# EAGLE design Herfstkamp v1 (EAGLE 7.1.0)
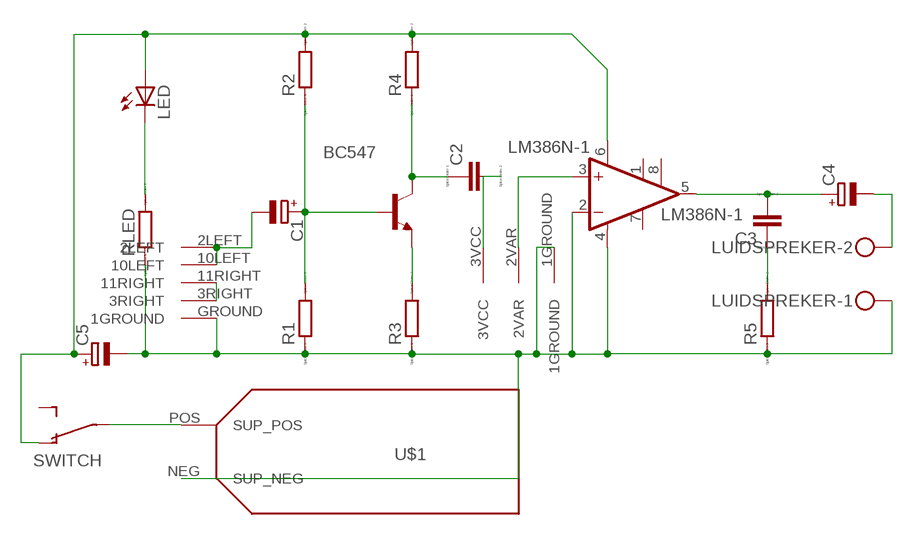
[diagram p0: schematic, sheet 1]

## Parts
BC547  -NPN-TO92-CBE  [TO92-CBE]
C1  CPOL-EUE2-5  [E2-5]
C2  C-EU050-024X044  [C050-024X044]
C3  C-EU050-024X044  [C050-024X044]
C4  CPOL-EUE2.5-6  [E2,5-6]
C5  CPOL-EUE3.5-8  [E3,5-8]
LED  LED5MM  [LED5MM]
LM386N-1  LM386N-1  [DIL08]
LUIDSPREKER  MKDSN1,5/2-5,08  [MKDSN1,5/2-5,08]
POTENTIOMETER  POTENTIOMETERALPS  [POTENTIOMETERALPS]
R1  R-EU_0207_10  [0207/10]
R2  R-EU_0207_10  [0207/10]
R3  R-EU_0207_10  [0207/10]
R4  R-EU_0207_10  [0207/10]
R5  R-EU_0207_10  [0207/10]
RLED  R-EU_0207_10  [0207/10]
SWITCH  SPDT_OS102011MAQN1  [OS102011MA1Q]
U$1  BATTERY_HOLDER9V  [BAT_HOLDER_9V]
U$2  INPUTJACK  [JACKSOCKET35RAPC4BHN2]

## Nets
GROUND: C5.- LM386N-1.2(-IN) LM386N-1.4(GND) LUIDSPREKER.1 POTENTIOMETER.1GROUND R1.1 R3.1 R5.1 RLED.1 U$1.NEG(SUP_NEG) U$2.GROUND(1GROUND)
N$1: LED.K(C) RLED.2
N$2: BC547.E R3.2
N$3: BC547.C C2.1 R4.1
N$4: C2.2 POTENTIOMETER.3VCC
N$5: C3.2 C4.+ LM386N-1.5(OUT)
N$6: C3.1 R5.2
N$7: SWITCH.P$2(P) U$1.POS(SUP_POS)
N$8: LM386N-1.3(+IN) POTENTIOMETER.2VAR
N$9: BC547.B C1.+ R1.2 R2.1
N$10: C5.+ LED.A LM386N-1.6(VS) R2.2 R4.2 SWITCH.P$1(O1)
N$11: C4.- LUIDSPREKER.2
N$12: U$2.3RIGHT U$2.11RIGHT
N$13: C1.- U$2.2LEFT U$2.10LEFT
Unconnected: LM386N-1.1(GAIN) LM386N-1.7(BYPASS) LM386N-1.8(GAIN) SWITCH.P$3(O2)

## Library data of the parts
BC547 = transistor-neu-to92:*-NPN-: NPN Transistror
C1 C4 C5 = resistor:CPOL-EU: POLARIZED CAPACITOR, European symbol
C2 C3 = resistor:C-EU: CAPACITOR, European symbol; SPICEPREFIX: C
LED = led:LED: LED OSRAM: - CHIPLED LG R971, LG N971, LY N971, LG Q971, LY Q971, LO R971, LY R971 LH N974, LH R974 LS Q976, LO Q976, LY Q976 LO Q996 - Hyper CHIPLED LW Q18S LB Q993, LB Q99A, LB R99A - SideLED LS A670, LO A670, LY A670, LG A670, LP A670 LB A673, LV A673, LT A673, LW A673 LH A674 LY A675 LS A676, LA A676, LO A676, LY A676, LW A676 LS A679, LY A679, LG A679 - Hyper Micro SIDELED® LS Y876, LA Y876, LO Y876, LY Y876 LT Y87S - SmartLED LW L88C, LW L88S LB L89C, LB L89S, LG L890 LS L89K, LO L89K, LY L89K LS L896, LA L896, LO L896, LY L896 - TOPLED LS T670, LO T670, LY T670, LG T670, LP T670 LSG T670, LSP T670, LSY T670, LOP T670, LYG T670 LG T671, LOG T671, LSG T671 LB T673, LV T673, LT T673, LW T673 LH T674 LS T676, LA T676, LO T676, LY T676, LB T676, LH T676, LSB T676, LW T676 LB T67C, LV T67C, LT T67C, LS T67K, LO T67K, LY T67K, LW E67C LS E67B, LA E67B, LO E67B, LY E67B, LB E67C, LV E67C, LT E67C LW T67C LS T679, LY T679, LG T679 LS T770, LO T770, LY T770, LG T770, LP T770 LB T773, LV T773, LT T773, LW T773 LH T774 LS E675, LA E675, LY E675, LS T675 LS T776, LA T776, LO T776, LY T776, LB T776 LHGB T686 LT T68C, LB T68C - Hyper Mini TOPLED® LB M676 - Mini TOPLED Santana® LG M470 LS M47K, LO M47K, LY M47K Source: http://www.osram.convergy.de LUXEON: - LUMILED® LXK2-PW12-R00, LXK2-PW12-S00, LXK2-PW14-U00, LXK2-PW14-V00 LXK2-PM12-R00, LXK2-PM12-S00, LXK2-PM14-U00 LXK2-PE12-Q00, LXK2-PE12-R00, LXK2-PE12-S00, LXK2-PE14-T00, LXK2-PE14-U00 LXK2-PB12-K00, LXK2-PB12-L00, LXK2-PB12-M00, LXK2-PB14-N00, LXK2-PB14-P00, LXK2-PB14-Q00 LXK2-PR12-L00, LXK2-PR12-M00, LXK2-PR14-Q00, LXK2-PR14-R00 LXK2-PD12-Q00, LXK2-PD12-R00, LXK2-PD12-S00 LXK2-PH12-R00, LXK2-PH12-S00 LXK2-PL12-P00, LXK2-PL12-Q00, LXK2-PL12-R00 Source: www.luxeon.com KINGBRIGHT: KA-3528ASYC Source: www.kingbright.com
LM386N-1 = linear:LM386?-*: Low Voltage Audio Power Amplifier Source: http://cache.national.com/ds/LM/LM386.pdf
LUIDSPREKER = con-phoenix-508:MKDSN1,5/2-5,08: MKDSN 1,5/ 2-5,08 Printklemme Nennstrom: 13,5 A Nennspannung: 250 V Rastermaß: 5,08 mm Polzahl: 2 Anschlussart: Schraubanschluss Montage: Löten Anschlussrichtung Leiter/Platine: 0 ° Artikelnummer: 1729128 Source: http://eshop.phoenixcontact.com .. 1729128.pdf
POTENTIOMETER = Potentiometeralps:POTENTIOMETERALPS
R1-R5 RLED = resistor:R-EU_: RESISTOR, European symbol; SPICEPREFIX: R
SWITCH = switchcustom:SPDT: MARQUARDT SWITCH
U$1 = Batteryholder9v:BATTERY_HOLDER9V
U$2 = JackSocket:INPUTJACK

## Board
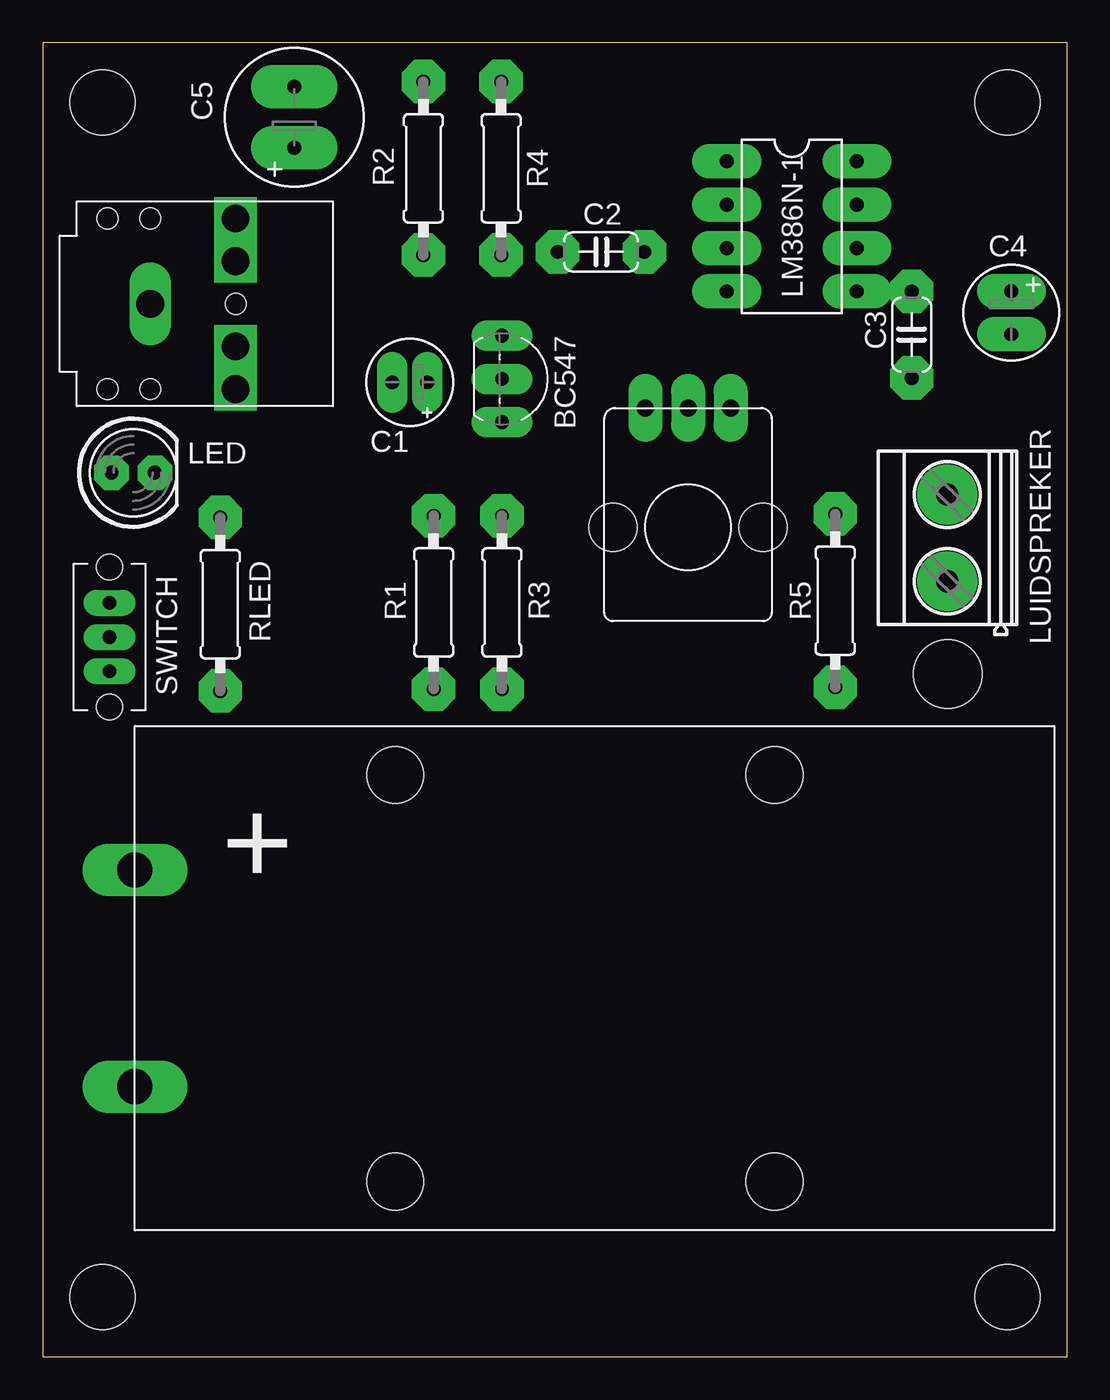
[diagram p1: board, top side]
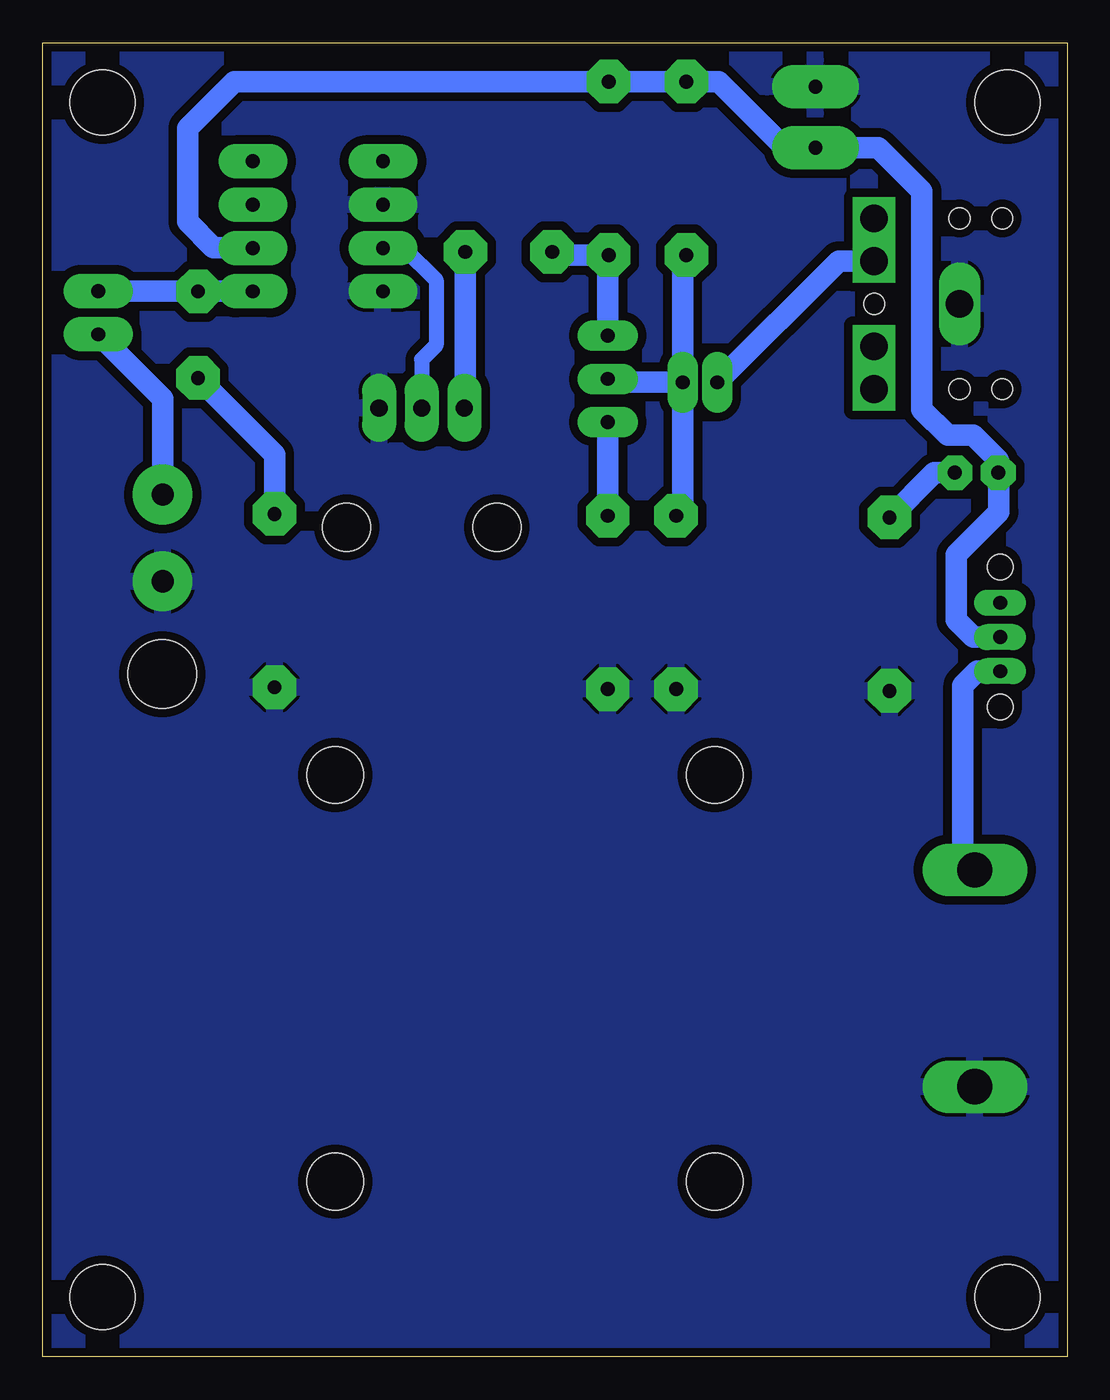
[diagram p2: board, bottom side, seen from below]

Size 60 x 77 mm. Coordinates in mm from the lower left corner, seen from the top.
Outline: 0,0 60,0 60,77 0,77 0,0
Copper layers 16: Bottom 0.035mm
Design rules "eC_1Layer_PClass6_BaseCopperO35_eCDefault *": minimum track width 0.15mm, minimum drill 0.35mm, track to track 10mil, track to pad 10mil, pad to pad 10mil, via to via 10mil, smd to smd 10mil, copper to edge 0.25mm, drill to drill 0.35mm, minimum pad ring 0.3mm, minimum via ring 0.3mm, stop-mask expansion 0mil, vias tented up to drill 0.45mm, thermal gap 0.2mm
Holes 3.8 mm at 3.5,3.5 56.5,73.5 56.5,3.5 3.5,73.5
Holes 4 mm at 53,40

### Footprints (pad centres in the part's own frame; a part is rotated, then mirrored left to right if it is on the bottom)
TO92-CBE = drill 0.813 pad 1.778 long: B 0,0; C -2.54,0; E 2.54,0
E2-5 = drill 0.813 pad 1.778 long: + -1.016,0; - 1.016,0
C050-024X044 = drill 0.813 pad 2.54 octagon: 1 -2.54,0; 2 2.54,0
E2,5-6 = drill 0.813 pad 2.032 long: + -1.27,0; - 1.27,0
E3,5-8 = drill 0.813 pad 2.54 long: + -1.778,0; - 1.778,0
LED5MM = drill 0.813 pad 2.032 octagon: A -1.27,0; K 1.27,0
DIL08 = drill 0.813 pad 2.032 long: 1 -3.81,-3.81; 2 -1.27,-3.81; 3 1.27,-3.81; 4 3.81,-3.81; 5 3.81,3.81; 6 1.27,3.81; 7 -1.27,3.81; 8 -3.81,3.81
MKDSN1,5/2-5,08 = drill 1.3 pad 3.5: 1 -2.561,0.025; 2 2.519,0.025
POTENTIOMETERALPS = drill 1 pad 2 long: 1GROUND 0,0; 2VAR 2.5,0; 3VCC 5,0 | hole 2.8: -1.9,7; 6.9,7
0207/10 = drill 0.813 pad 2.54 octagon: 1 -5.08,0; 2 5.08,0
OS102011MA1Q = drill 0.8 pad 1.524 long: P$1 0,0; P$2 2,0; P$3 -2,0 | hole 1.499: 4.1,0 | hole 1.5: -4.1,0
BAT_HOLDER_9V = drill 2.057 long: NEG 0,8.433; POS 0,21.133 | hole 3.302: 15.24,2.87; 37.465,2.87; 15.24,26.695; 37.465,26.695
JACKSOCKET35RAPC4BHN2 = drill 1.62 pad 2.5 square: 2LEFT 7.5,10; 3RIGHT 7.5,0; 10LEFT 7.5,7.5; 11RIGHT 7.5,2.5 | drill 1.62 pad 2 long: GROUND 2.5,5 | hole 1.2: 0,0; 2.5,0; 2.5,10; 0,10; 7.5,5

### Placement (x,y rotation side)
BC547  26.9,57.3 270 top
C1  21.5,57.1 180 top
C2  32.7,64.74 0 top
C3  50.9,59.89 90 top
C4  56.74,61.18 270 top
C5  14.74,72.63 90 top
LED  5.3,51.8 0 top
LM386N-1  43.88,66.24 270 top
LUIDSPREKER  53,48 90 top
POTENTIOMETER  40.3,55.6 180 top
R1  22.9,44.2 90 top
R2  22.3,69.64 90 top
R3  26.9,44.2 90 top
R4  26.85,69.64 90 top
R5  46.42,44.31 90 top
RLED  10.4,44.1 90 top
SWITCH  3.92,42.17 270 top
U$1  5.4,7.4 0 top
U$2  3.8,56.7 0 top

### Tracks (layer width: path | path; a pad name or v marks a point on that pad's centre or on a via)
GROUND
  pour Bottom (isolate 0.508): 0,77 60,77 60,0 0,0
N$1
  Bottom 1.27: LED.K 7.78,51.8 RLED.2
N$2
  Bottom 1.27: BC547.E R3.2
N$3
  Bottom 1.27: C2.1 29.98,64.56 R4.1 26.9,64.51 BC547.C
N$4
  Bottom 1.27: C2.2 35.24,55.66 POTENTIOMETER.3VCC
N$5
  Bottom 1.27: LM386N-1.5 C3.2 56.72,62.43 C4.+
N$6
  Bottom 1.27: R5.2 46.42,52.87 C3.1
N$7
  Bottom 1.27: U$1.POS 6.1,29.23 6.1,39.34 5.26,40.17 SWITCH.P$2
N$8
  Bottom 0.889: LM386N-1.3 38.84,64.97 36.96,63.09 36.96,59.28 37.8,58.43 POTENTIOMETER.2VAR
N$9
  Bottom 1.27: C1.+ 22.52,64.5 R2.1 | C1.+ 26.7,57.1 BC547.B | C1.+ 22.52,49.66 R1.2
N$10
  Bottom 1.27: LM386N-1.6 47.72,65 50,65 51.5,66.5 51.5,72 48.78,74.72 R4.2 R2.2 20.4,74.72 16.53,70.86 C5.+ 11.07,70.86 8.5,68.28 8.5,55.5 7,54 5.5,54 4.03,52.53 LED.A 4,51.77 4,49.5 6.5,47 6.5,43.17 5.5,42.17 SWITCH.P$1
N$11
  Bottom 1.27: LUIDSPREKER.2 52.98,56.15 C4.-
N$12
  Bottom 1.27: U$2.11RIGHT U$2.3RIGHT
N$13
  Bottom 1.27: U$2.2LEFT U$2.10LEFT 13.38,64.2 C1.-